# EAGLE design mainboard (EAGLE 6.6.0)
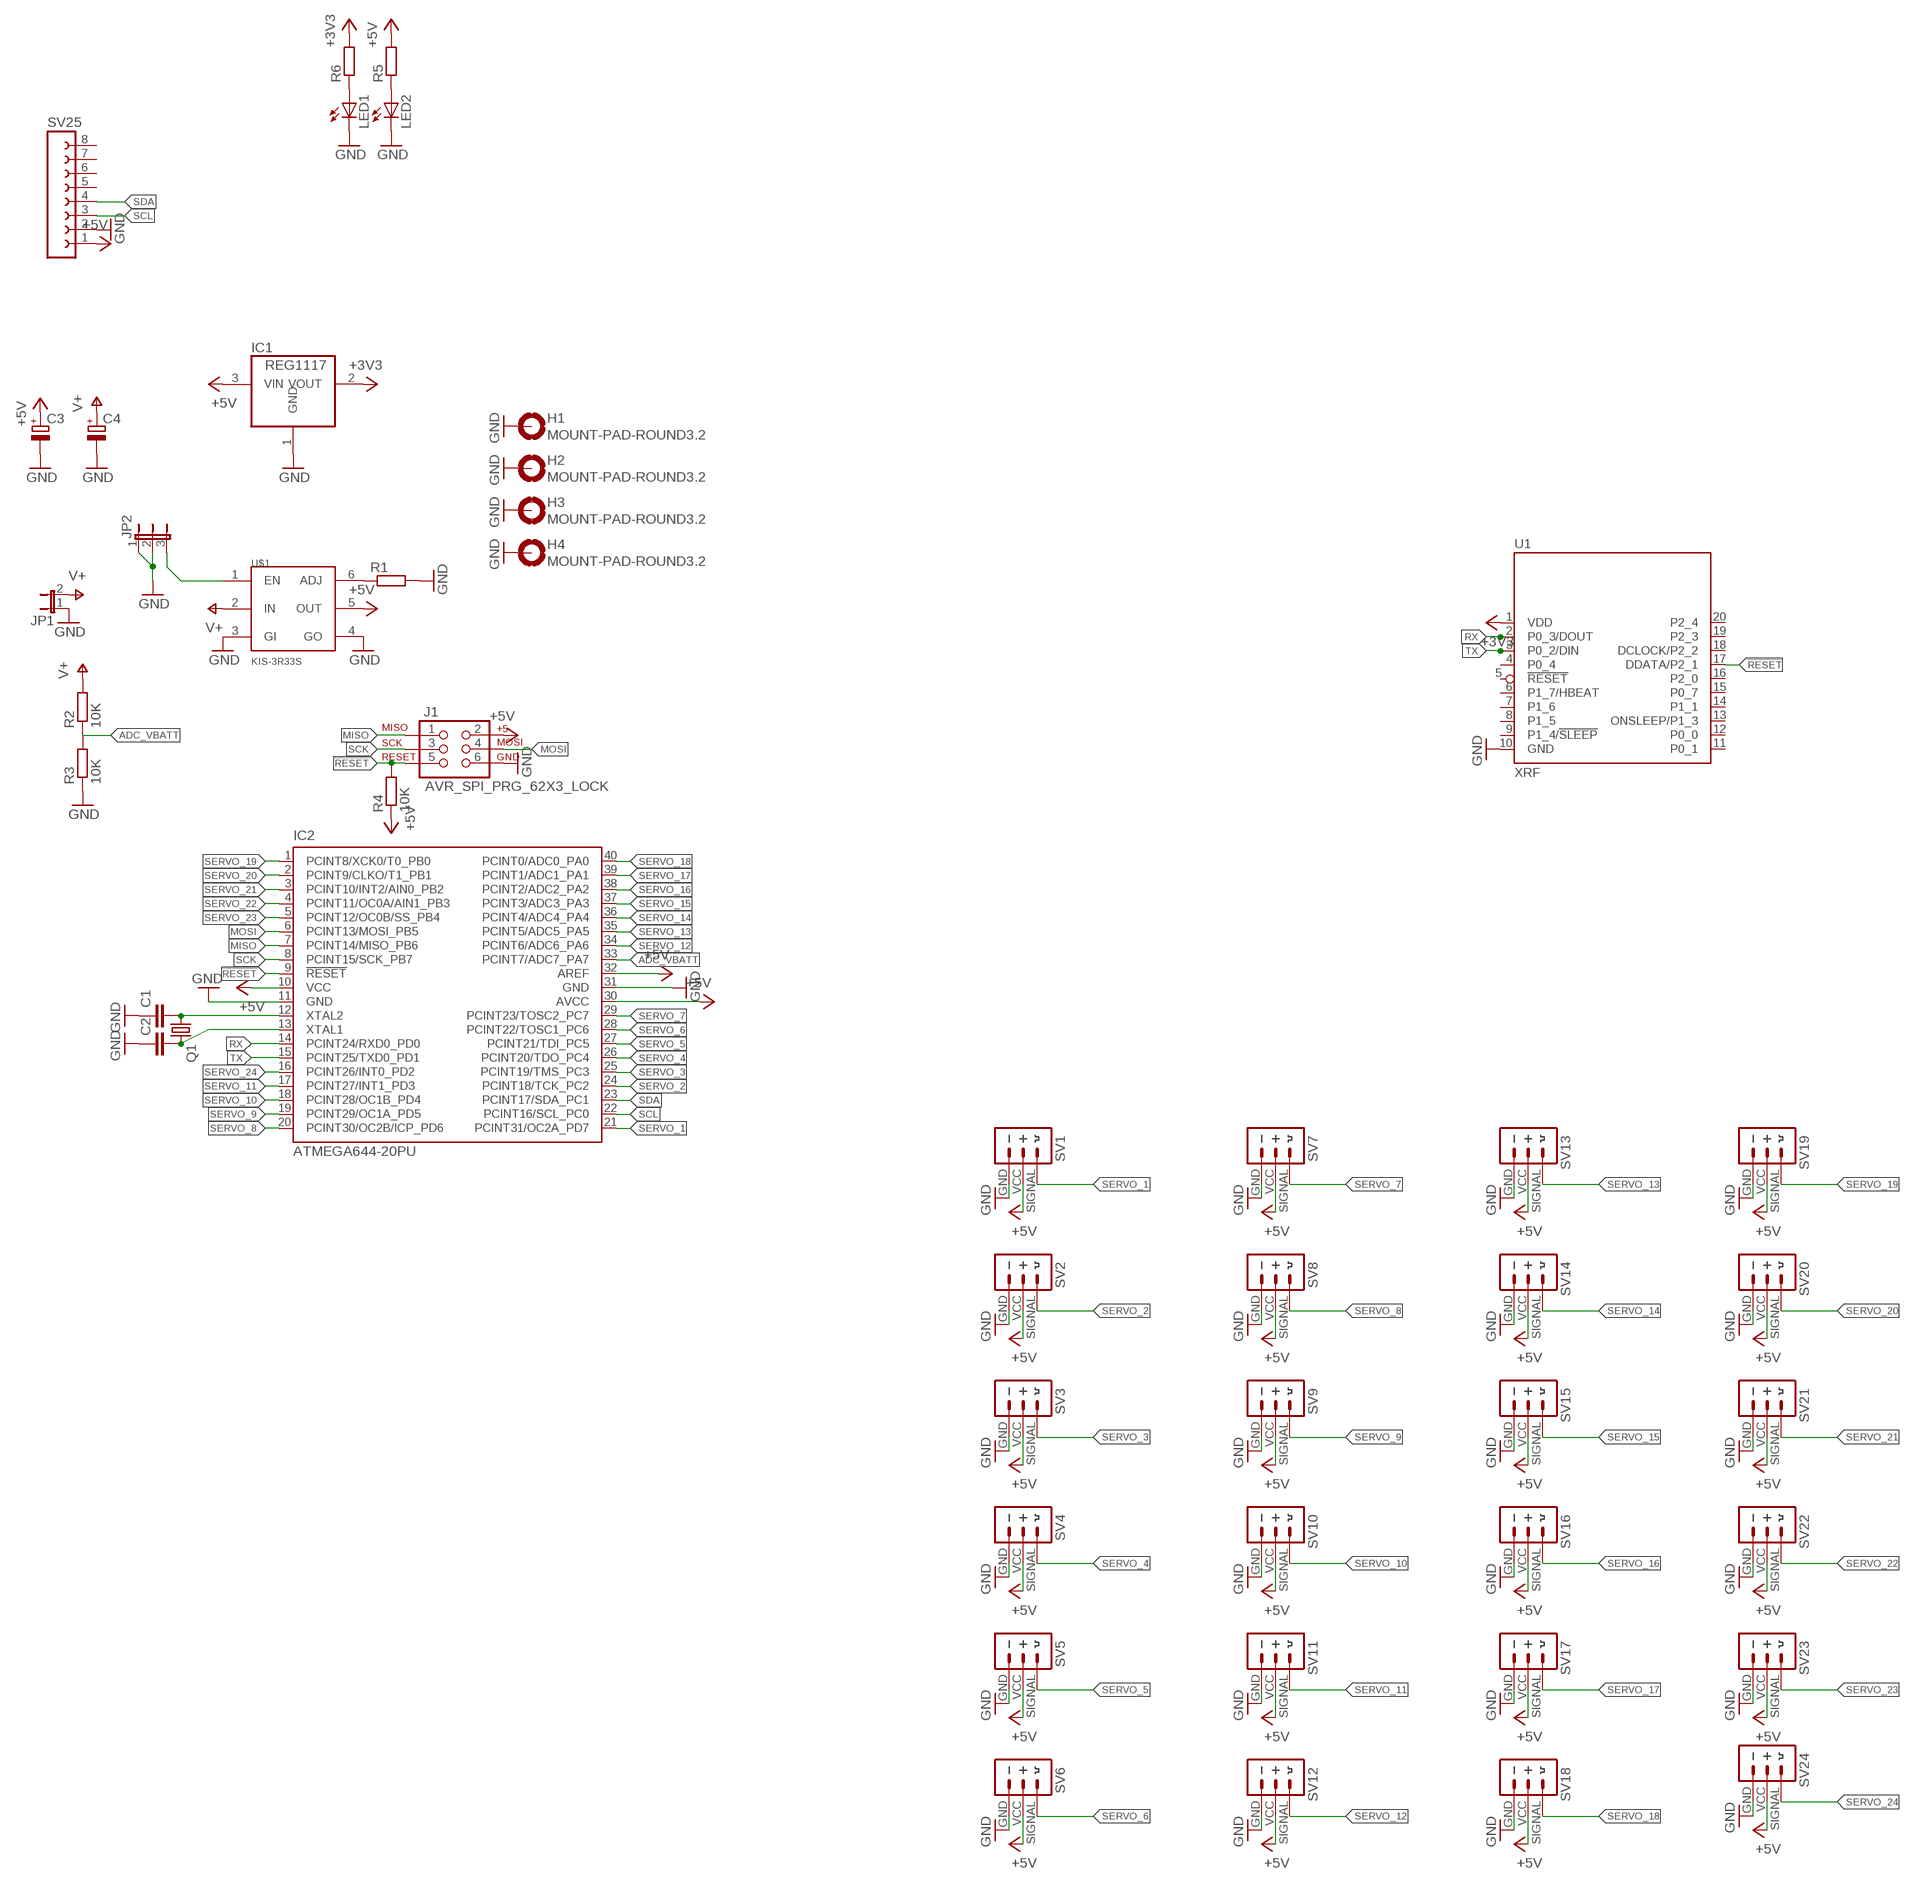
[diagram p0: schematic, sheet 1]

## Parts
C1  C-EU025-025X050  [C025-025X050]
C2  C-EU025-025X050  [C025-025X050]
C3  CPOL-EUE2.5-7  [E2,5-7]
C4  CPOL-EUE2.5-7  [E2,5-7]
H1  MOUNT-PAD-ROUND3.2  [3,2-PAD]
H2  MOUNT-PAD-ROUND3.2  [3,2-PAD]
H3  MOUNT-PAD-ROUND3.2  [3,2-PAD]
H4  MOUNT-PAD-ROUND3.2  [3,2-PAD]
IC1  REG1117  [SOT223]
IC2  ATMEGA644-20PU  [DIL40]
J1  AVR_SPI_PRG_62X3_LOCK  [2X3_LOCK]
JP1  JP1E  [JP1]
JP2  JP2E  [JP2]
LED1  LED5MM  [LED5MM]
LED2  LED5MM  [LED5MM]
Q1  CRYSTALHC49U-V  [HC49U-V]
R1  R-EU_0207/10  [0207/10]
R2  10K  R-EU_0204/5  [0204/5]
R3  10K  R-EU_0204/5  [0204/5]
R4  10K  R-EU_0204/2V  [0204V]
R5  R-EU_0204/2V  [0204V]
R6  R-EU_0204/2V  [0204V]
SV1  SERVO  [SERVO]
SV2  SERVO  [SERVO]
SV3  SERVO  [SERVO]
SV4  SERVO  [SERVO]
SV5  SERVO  [SERVO]
SV6  SERVO  [SERVO]
SV7  SERVO  [SERVO]
SV8  SERVO  [SERVO]
SV9  SERVO  [SERVO]
SV10  SERVO  [SERVO]
SV11  SERVO  [SERVO]
SV12  SERVO  [SERVO]
SV13  SERVO  [SERVO]
SV14  SERVO  [SERVO]
SV15  SERVO  [SERVO]
SV16  SERVO  [SERVO]
SV17  SERVO  [SERVO]
SV18  SERVO  [SERVO]
SV19  SERVO  [SERVO]
SV20  SERVO  [SERVO]
SV21  SERVO  [SERVO]
SV22  SERVO  [SERVO]
SV23  SERVO  [SERVO]
SV24  SERVO  [SERVO]
SV25  FE08-1  [FE08]
U1  XRF  [XRF]
U$1  KIS-3R33S  [KIS-3R33S]

## Nets
!RESET: IC2.9(!RESET) J1.5 R4.2 U1.17(DDATA/P2_1)
+3V3: IC1.2(VOUT) R6.2 U1.1(VDD)
+5V: C3.+ IC1.3(VIN) IC2.10(VCC) IC2.30(AVCC) IC2.32(AREF) J1.2 R4.1 R5.2 SV1.VCC SV2.VCC SV3.VCC SV4.VCC SV5.VCC SV6.VCC SV7.VCC SV8.VCC SV9.VCC SV10.VCC SV11.VCC SV12.VCC SV13.VCC SV14.VCC SV15.VCC SV16.VCC SV17.VCC SV18.VCC SV19.VCC SV20.VCC SV21.VCC SV22.VCC SV23.VCC SV24.VCC SV25.1 U$1.5(OUT)
ADC_VBATT: IC2.33(PCINT7/ADC7_PA7) R2.1 R3.2
GND: C1.1 C2.1 C3.- C4.- H1.B3,2(MOUNT) H2.B3,2(MOUNT) H3.B3,2(MOUNT) H4.B3,2(MOUNT) IC1.1(GND) IC2.11(GND) IC2.31(GND) J1.6 JP1.1 JP2.1 JP2.2 LED1.K(C) LED2.K(C) R1.2 R3.1 SV1.GND SV2.GND SV3.GND SV4.GND SV5.GND SV6.GND SV7.GND SV8.GND SV9.GND SV10.GND SV11.GND SV12.GND SV13.GND SV14.GND SV15.GND SV16.GND SV17.GND SV18.GND SV19.GND SV20.GND SV21.GND SV22.GND SV23.GND SV24.GND SV25.2 U1.10(GND) U$1.3(GI) U$1.4(GO)
MISO: IC2.7(PCINT14/MISO_PB6) J1.1
MOSI: IC2.6(PCINT13/MOSI_PB5) J1.4
N$1: R1.1 U$1.6(ADJ)
N$2: C1.2 IC2.12(XTAL2) Q1.1
N$3: C2.2 IC2.13(XTAL1) Q1.2
N$4: JP2.3 U$1.1(EN)
N$5: LED2.A R5.1
N$6: LED1.A R6.1
RX: IC2.14(PCINT24/RXD0_PD0) U1.2(P0_3/DOUT)
SCK: IC2.8(PCINT15/SCK_PB7) J1.3
SCL: IC2.22(PCINT16/SCL_PC0) SV25.3
SDA: IC2.23(PCINT17/SDA_PC1) SV25.4
SERVO_1: IC2.21(PCINT31/OC2A_PD7) SV1.SIGNAL
SERVO_2: IC2.24(PCINT18/TCK_PC2) SV2.SIGNAL
SERVO_3: IC2.25(PCINT19/TMS_PC3) SV3.SIGNAL
SERVO_4: IC2.26(PCINT20/TDO_PC4) SV4.SIGNAL
SERVO_5: IC2.27(PCINT21/TDI_PC5) SV5.SIGNAL
SERVO_6: IC2.28(PCINT22/TOSC1_PC6) SV6.SIGNAL
SERVO_7: IC2.29(PCINT23/TOSC2_PC7) SV7.SIGNAL
SERVO_8: IC2.20(PCINT30/OC2B/ICP_PD6) SV8.SIGNAL
SERVO_9: IC2.19(PCINT29/OC1A_PD5) SV9.SIGNAL
SERVO_10: IC2.18(PCINT28/OC1B_PD4) SV10.SIGNAL
SERVO_11: IC2.17(PCINT27/INT1_PD3) SV11.SIGNAL
SERVO_12: IC2.34(PCINT6/ADC6_PA6) SV12.SIGNAL
SERVO_13: IC2.35(PCINT5/ADC5_PA5) SV13.SIGNAL
SERVO_14: IC2.36(PCINT4/ADC4_PA4) SV14.SIGNAL
SERVO_15: IC2.37(PCINT3/ADC3_PA3) SV15.SIGNAL
SERVO_16: IC2.38(PCINT2/ADC2_PA2) SV16.SIGNAL
SERVO_17: IC2.39(PCINT1/ADC1_PA1) SV17.SIGNAL
SERVO_18: IC2.40(PCINT0/ADC0_PA0) SV18.SIGNAL
SERVO_19: IC2.1(PCINT8/XCK0/T0_PB0) SV19.SIGNAL
SERVO_20: IC2.2(PCINT9/CLKO/T1_PB1) SV20.SIGNAL
SERVO_21: IC2.3(PCINT10/INT2/AIN0_PB2) SV21.SIGNAL
SERVO_22: IC2.4(PCINT11/OC0A/AIN1_PB3) SV22.SIGNAL
SERVO_23: IC2.5(PCINT12/OC0B/SS_PB4) SV23.SIGNAL
SERVO_24: IC2.16(PCINT26/INT0_PD2) SV24.SIGNAL
TX: IC2.15(PCINT25/TXD0_PD1) U1.3(P0_2/DIN)
V+: C4.+ JP1.2 R2.2 U$1.2(IN)
Unconnected: SV25.5 SV25.6 SV25.7 SV25.8 U1.4(P0_4) U1.5(!RESET) U1.6(P1_7/HBEAT) U1.7(P1_6) U1.8(P1_5) U1.9(P1_4/!SLEEP) U1.11(P0_1) U1.12(P0_0) U1.13(ONSLEEP/P1_3) U1.14(P1_1) U1.15(P0_7) U1.16(P2_0) U1.18(DCLOCK/P2_2) U1.19(P2_3) U1.20(P2_4)

## Library data of the parts
C1 C2 = rcl:C-EU: CAPACITOR, European symbol
C3 C4 = rcl:CPOL-EU: POLARIZED CAPACITOR, European symbol
H1-H4 = holes:MOUNT-PAD-ROUND: MOUNTING PAD, round
IC1 = burr-brown:REG1117: 800mA and 1A Low Dropout (LDO) Positive Regulator 1.8V, 2.5V, 2.85V, 3.3V, 5V, and Adj; MPN: REG1117; OC_FARNELL: 1097566; OC_NEWARK: 14P6981
IC2 = atmel:ATMEGA644-*PU: 8-bit Microcontroller with 64K Bytes In-System Programmable Flash Auto generated by make-symbol-device-package-bsdl.ulp Rev. 34 Source: http://www.atmel.com/dyn/resources/prod_documents/doc2593.pdf; MPN: ATMEGA644-20PU; OC_FARNELL: 1288340; OC_NEWARK: 23M5060
J1 = avr_prog:AVR_SPI_PRG_6: AVR ISP 6 Pin This is the reduced ISP connector for AVR programming. Common on Arduino. This footprint will take up less PCB space and can be used with a 10-pin to 6-pin adapter such as SKU: BOB-08508
JP1 = jumper:JP1E: JUMPER
JP2 = jumper:JP2E: JUMPER
LED1 LED2 = led:LED: LED OSRAM: - CHIPLED LG R971, LG N971, LY N971, LG Q971, LY Q971, LO R971, LY R971 LH N974, LH R974 LS Q976, LO Q976, LY Q976 LO Q996 - Hyper CHIPLED LW Q18S LB Q993, LB Q99A, LB R99A - SideLED LS A670, LO A670, LY A670, LG A670, LP A670 LB A673, LV A673, LT A673, LW A673 LH A674 LY A675 LS A676, LA A676, LO A676, LY A676, LW A676 LS A679, LY A679, LG A679 - Hyper Micro SIDELED® LS Y876, LA Y876, LO Y876, LY Y876 LT Y87S - SmartLED LW L88C, LW L88S LB L89C, LB L89S, LG L890 LS L89K, LO L89K, LY L89K LS L896, LA L896, LO L896, LY L896 - TOPLED LS T670, LO T670, LY T670, LG T670, LP T670 LSG T670, LSP T670, LSY T670, LOP T670, LYG T670 LG T671, LOG T671, LSG T671 LB T673, LV T673, LT T673, LW T673 LH T674 LS T676, LA T676, LO T676, LY T676, LB T676, LH T676, LSB T676, LW T676 LB T67C, LV T67C, LT T67C, LS T67K, LO T67K, LY T67K, LW E67C LS E67B, LA E67B, LO E67B, LY E67B, LB E67C, LV E67C, LT E67C LW T67C LS T679, LY T679, LG T679 LS T770, LO T770, LY T770, LG T770, LP T770 LB T773, LV T773, LT T773, LW T773 LH T774 LS E675, LA E675, LY E675, LS T675 LS T776, LA T776, LO T776, LY T776, LB T776 LHGB T686 LT T68C, LB T68C - Hyper Mini TOPLED® LB M676 - Mini TOPLED Santana® LG M470 LS M47K, LO M47K, LY M47K Source: http://www.osram.convergy.de LUXEON: - LUMILED® LXK2-PW12-R00, LXK2-PW12-S00, LXK2-PW14-U00, LXK2-PW14-V00 LXK2-PM12-R00, LXK2-PM12-S00, LXK2-PM14-U00 LXK2-PE12-Q00, LXK2-PE12-R00, LXK2-PE12-S00, LXK2-PE14-T00, LXK2-PE14-U00 LXK2-PB12-K00, LXK2-PB12-L00, LXK2-PB12-M00, LXK2-PB14-N00, LXK2-PB14-P00, LXK2-PB14-Q00 LXK2-PR12-L00, LXK2-PR12-M00, LXK2-PR14-Q00, LXK2-PR14-R00 LXK2-PD12-Q00, LXK2-PD12-R00, LXK2-PD12-S00 LXK2-PH12-R00, LXK2-PH12-S00 LXK2-PL12-P00, LXK2-PL12-Q00, LXK2-PL12-R00 Source: www.luxeon.com KINGBRIGHT: KA-3528ASYC Source: www.kingbright.com
Q1 = crystal:CRYSTAL: CRYSTAL; OC_FARNELL: 1666969; OC_NEWARK: unknown
R1-R6 = rcl:R-EU_: RESISTOR, European symbol
SV1-SV24 = parag0n:SERVO: SERVO CONNECTOR Standard pinout servo connector
SV25 = con-lsta:FE08-1: FEMALE HEADER; OC_FARNELL: unknown; OC_NEWARK: unknown
U1 = Ciseco%20Footprints:XRF: XRF Wireless UART Serial Data Module. www.ciseco.co.uk
U$1 = KIS-3R33S:KIS-3R33S: DC-DC Converter

## Board
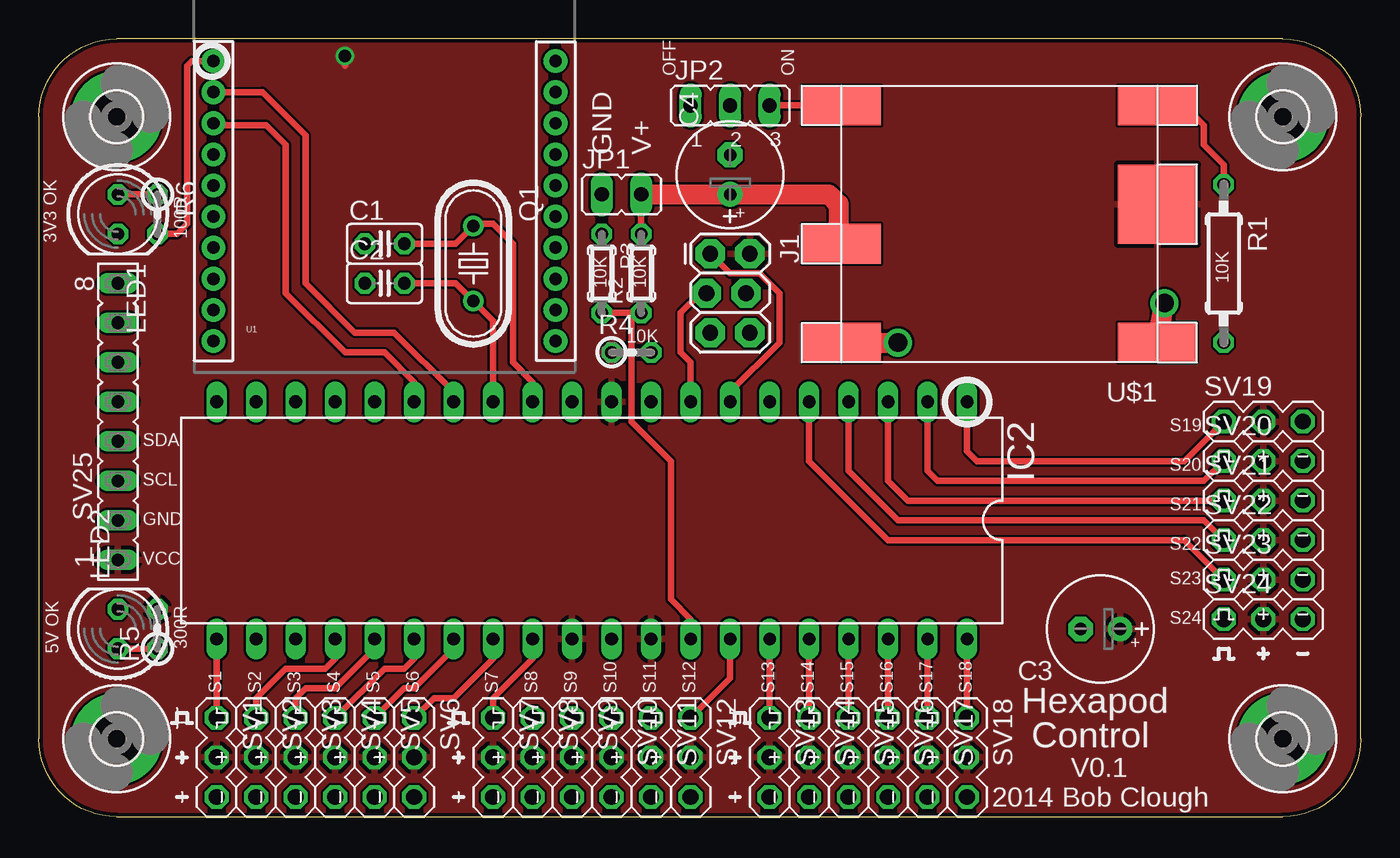
[diagram p1: board, top side]
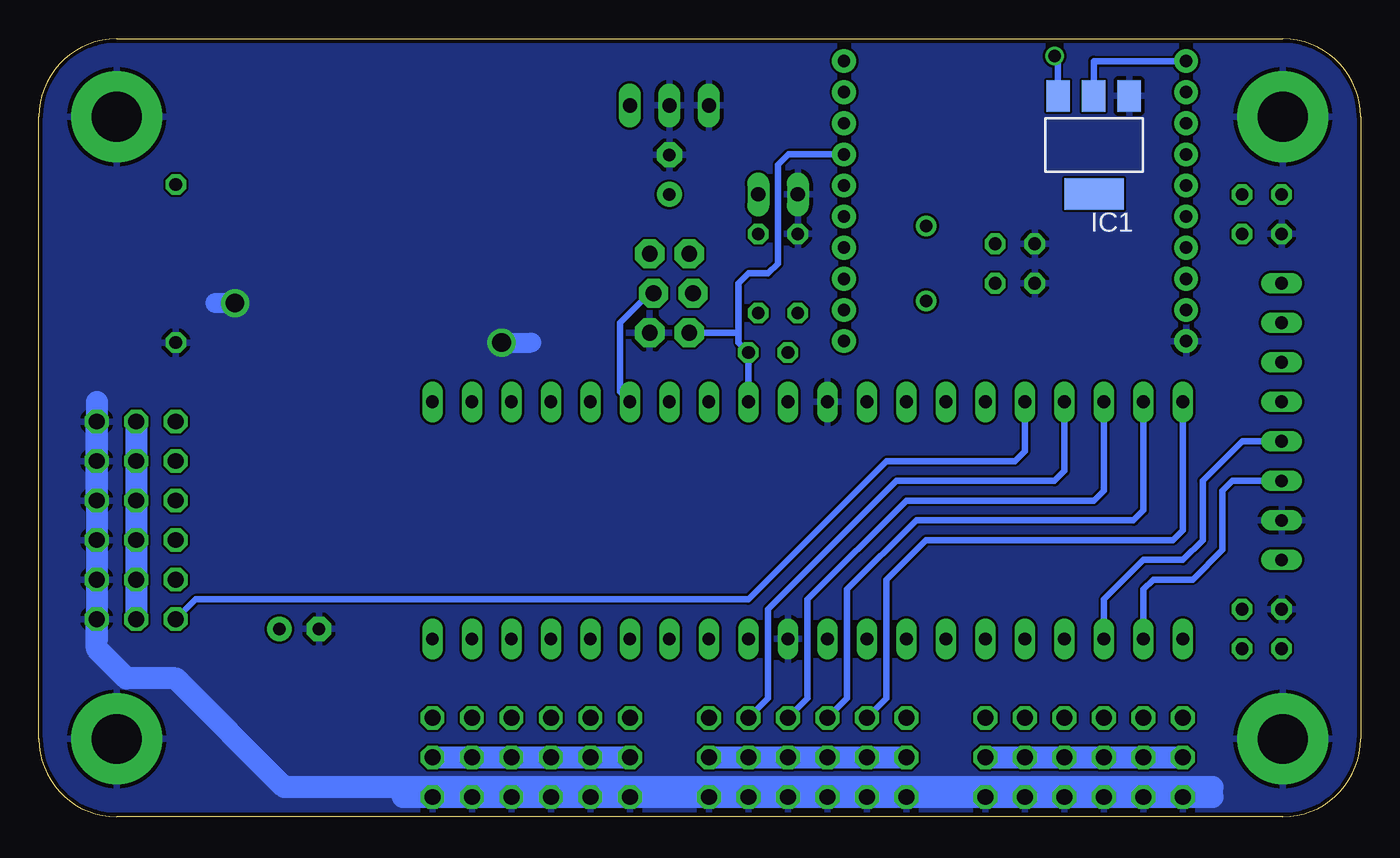
[diagram p2: board, bottom side, seen from below]

Size 85 x 50 mm. Coordinates in mm from the lower left corner, seen from the top.
Outline: 5,0 80,0 arc90 85,5 85,45 arc90 80,50 5,50 arc90 0,45 0,5 arc90 5,0
Copper layers (1*16): Top 0.035mm / dielectric 1.5mm / Bottom 0.035mm
Design rules "Elecrow_2-layer_eagle_rule": minimum track width 6mil, minimum drill 12mil, track to track 6mil, track to pad 6mil, pad to pad 6mil, via to via 6mil, smd to smd 0mil, copper to edge 10mil, drill to drill 10mil, minimum pad ring 10mil, minimum via ring 6mil, stop-mask expansion 2mil, vias tented up to drill 100mil, thermal gap 10mil
bRestrict: 8 lines

### Footprints (pad centres in the part's own frame; a part is rotated, then mirrored left to right if it is on the bottom)
C025-025X050 = drill 0.813 octagon: 1 -1.27,0; 2 1.27,0
E2,5-7 = drill 0.813 pad 1.6: + -1.27,0 | drill 0.813 pad 1.6 octagon: - 1.27,0
3,2-PAD = drill 3.2 pad 5.842: B3,2 0,0
SOT223 = smd 1.499 x 2.007: 1 -2.261,-3.15; 2 0.025,-3.15; 3 2.311,-3.15 | smd 3.81 x 2.007: 4 0,3.15
DIL40 = drill 0.813 long: 1 -24.13,-7.62; 2 -21.59,-7.62; 3 -19.05,-7.62; 4 -16.51,-7.62; 5 -13.97,-7.62; 6 -11.43,-7.62; 7 -8.89,-7.62; 8 -6.35,-7.62; 9 -3.81,-7.62; 10 -1.27,-7.62; 11 1.27,-7.62; 12 3.81,-7.62; 13 6.35,-7.62; 14 8.89,-7.62; 15 11.43,-7.62; 16 13.97,-7.62; 17 16.51,-7.62; 18 19.05,-7.62; 19 21.59,-7.62; 20 24.13,-7.62; 21 24.13,7.62; 22 21.59,7.62; 23 19.05,7.62; 24 16.51,7.62; 25 13.97,7.62; 26 11.43,7.62; 27 8.89,7.62; 28 6.35,7.62; 29 3.81,7.62; 30 1.27,7.62; 31 -1.27,7.62; 32 -3.81,7.62; 33 -6.35,7.62; 34 -8.89,7.62; 35 -11.43,7.62; 36 -13.97,7.62; 37 -16.51,7.62; 38 -19.05,7.62; 39 -21.59,7.62; 40 -24.13,7.62
2X3_LOCK = drill 1.016 pad 1.88 octagon: 1 0,0; 2 0,2.54; 3 2.54,-0.254; 4 2.54,2.286; 5 5.08,0; 6 5.08,2.54
JP1 = drill 0.914 long: 1 0,-1.27; 2 0,1.27
JP2 = drill 0.914 long: 1 -2.54,0; 2 0,0; 3 2.54,0
LED5MM = drill 0.813 octagon: A -1.27,0; K 1.27,0
HC49U-V = drill 0.813: 1 -2.413,0; 2 2.413,0
0207/10 = drill 0.813 octagon: 1 -5.08,0; 2 5.08,0
0204/5 = drill 0.813 octagon: 1 -2.54,0; 2 2.54,0
0204V = drill 0.813 octagon: 1 -1.27,0; 2 1.27,0
SERVO = drill 1.016 octagon: GND 2.54,0; SIGNAL -2.54,0; VCC 0,0
FE08 = drill 0.813 long: 1 -8.89,0; 2 -6.35,0; 3 -3.81,0; 4 -1.27,0; 5 1.27,0; 6 3.81,0; 7 6.35,0; 8 8.89,0
XRF = drill 0.8 pad 1.524: 1 -11,20; 2 -11,18; 3 -11,16; 4 -11,14; 5 -11,12; 6 -11,10; 7 -11,8; 8 -11,6; 9 -11,4; 10 -11,2; 11 11,2; 12 11,4; 13 11,6; 14 11,8; 15 11,10; 16 11,12; 17 11,14; 18 11,16; 19 11,18; 20 11,20
KIS-3R33S = smd 5.08 x 2.54: 1 10.16,-7.62; 2 10.16,1.27; 3 10.16,7.62; 4 -10.16,7.62; 6 -10.16,-7.62 | smd 5.08 x 5.08: 5 -10.16,-1.27

### Placement (x,y rotation side)
C1  22.23,36.83 0 top
C2  22.23,34.29 0 top
C3  68.26,12.06 180 top
C4  44.45,41.27 90 top
H1  5,5 0 top
H2  5,45 0 top
H3  80,45 0 top
H4  80,5 0 top
IC1  17.14,43.18 180 bottom
IC2  35.56,19.05 180 top
J1  43.18,36.2 270 top
JP1  37.47,40.01 270 top
JP2  44.45,45.72 0 top
LED1  5.08,38.73 270 top
LED2  5.08,12.06 90 top
Q1  27.94,35.56 270 top
R1  76.2,35.56 270 top
R2  38.73,34.92 90 top
R3  36.2,34.92 270 top
R4  38.1,29.84 0 top
R5  7.62,12.06 90 top
R6  7.62,38.73 270 top
SV1  11.43,3.81 270 top
SV2  13.97,3.81 270 top
SV3  16.51,3.81 270 top
SV4  19.05,3.81 270 top
SV5  21.59,3.81 270 top
SV6  24.13,3.81 270 top
SV7  29.21,3.81 270 top
SV8  31.75,3.81 270 top
SV9  34.29,3.81 270 top
SV10  36.83,3.81 270 top
SV11  39.37,3.81 270 top
SV12  41.91,3.81 270 top
SV13  46.99,3.81 270 top
SV14  49.53,3.81 270 top
SV15  52.07,3.81 270 top
SV16  54.61,3.81 270 top
SV17  57.15,3.81 270 top
SV18  59.69,3.81 270 top
SV19  78.74,25.4 0 top
SV20  78.74,22.86 0 top
SV21  78.74,20.32 0 top
SV22  78.74,17.78 0 top
SV23  78.74,15.24 0 top
SV24  78.74,12.7 0 top
SV25  5.08,25.4 90 top
U1  22.23,28.57 0 top
U$1  61.77,38.1 180 top

### Tracks (layer width: path | path; a pad name or v marks a point on that pad's centre or on a via)
!RESET
  Bottom 0.406: 39.37,27.94 IC2.9 R4.2 40.01,30.48 40.01,31.11 | U1.17 36.8,42.58 37.47,41.91 37.47,35.56 38.1,34.92 39.37,34.92 40.01,34.29 40.01,31.11 | J1.5 40.01,31.11
+3V3
  Top 0.406: R6.2 8.89,37.47 9.53,38.1 9.53,48.26 9.84,48.58 U1.1
  Bottom 0.406: IC1.2 17.17,48.58 U1.1
+5V  (via drill 0.8)
  Top 0.406: v19.68,48.9 19.68,48.26
  Bottom 0.406: IC1.3 19.46,48.67 v19.68,48.9
  Bottom 1.422: SV19.VCC SV24.VCC | SV18.VCC SV13.VCC | SV12.VCC SV7.VCC | SV6.VCC SV1.VCC
  pour Top: -0.64,53.98 87.47,53.98 87.47,-3.81 -0.64,-3.81
ADC_VBATT
  Top 0.406: R3.2 38.1,32.38 | 38.1,32.38 R2.1 | IC2.33 41.91,12.7 40.64,13.97 40.64,22.86 38.1,25.4 38.1,32.38
GND  (via drill 1.2)
  Top 1.27: U$1.3 v55.24,30.48 | U$1.4 v72.39,33.02
  Bottom 1.27: v55.24,30.48 53.34,30.48 | v72.39,33.02 73.66,33.02
  Bottom 1.422: SV1.GND 10.16,1.27 | SV24.GND 81.28,11.43 | 61.59,1.27 SV18.GND SV17.GND SV16.GND SV15.GND SV14.GND SV13.GND SV12.GND SV11.GND SV10.GND SV9.GND SV8.GND SV7.GND SV6.GND SV5.GND SV4.GND SV3.GND SV2.GND SV1.GND | SV1.GND 9.53,1.27 9.53,1.91 69.22,1.91 76.2,8.89 79.38,8.89 81.28,10.79 SV24.GND | SV24.GND SV23.GND SV22.GND SV21.GND | SV19.GND SV20.GND SV21.GND | SV21.GND SV19.GND | 81.28,26.67 SV19.GND
  pour Bottom: -1.91,50.8 89.93,50.8 89.93,-4.45 -1.91,-4.45
MISO
  Top 0.406: J1.1 44.45,34.92 46.35,34.92 47.62,33.66 47.62,30.48 44.45,27.3 IC2.7
MOSI
  Bottom 0.406: J1.4 45.72,33.66 47.62,31.75 47.62,27.3 IC2.6
N$1
  Top 0.406: U$1.6 73.66,45.72 74.93,44.45 74.93,43.18 76.2,41.91 R1.1
N$2
  Top 0.406: IC2.12 31.75,27.94 30.48,29.21 30.48,36.83 29.21,38.1 28.07,38.1 Q1.1 26.8,36.83 C1.2
N$3
  Top 0.406: IC2.13 29.21,31.88 Q1.2 26.8,34.29 C2.2
N$4
  Top 0.406: JP2.3 U$1.1
N$5
  Top 0.406: R5.1 LED2.A
N$6
  Top 0.406: R6.1 LED1.A
RX
  Top 0.406: IC2.14 26.67,27.3 22.86,31.11 20.32,31.11 17.14,34.29 17.14,43.81 14.38,46.58 U1.2
SCK
  Top 0.406: J1.3 42.55,33.66 41.27,32.38 41.27,29.84 41.91,29.21 IC2.8
SCL
  Bottom 0.406: SV25.3 8.26,21.59 8.89,20.95 8.89,17.14 10.79,15.24 13.34,15.24 13.97,14.61 IC2.22
SDA
  Bottom 0.406: SV25.4 7.62,24.13 10.16,21.59 10.16,17.78 11.43,16.51 13.97,16.51 16.51,13.97 IC2.23
SERVO_1
  Top 0.406: IC2.21 SV1.SIGNAL
SERVO_2
  Top 0.406: IC2.24 19.05,10.16 18.41,9.53 15.88,9.53 13.97,7.62 SV2.SIGNAL
SERVO_3
  Top 0.406: IC2.25 21.59,10.79 19.05,8.26 17.14,8.26 16.51,7.62 SV3.SIGNAL
SERVO_4
  Top 0.406: IC2.26 24.13,10.16 23.5,9.53 22.23,9.53 SV4.SIGNAL
SERVO_5
  Top 0.406: IC2.27 26.67,10.79 24.13,8.26 23.5,8.26 SV5.SIGNAL
SERVO_6
  Top 0.406: IC2.28 29.21,10.16 26.67,7.62 25.4,7.62 SV6.SIGNAL
SERVO_7
  Top 0.406: IC2.29 31.75,10.16 29.21,7.62 SV7.SIGNAL
SERVO_8
  Bottom 0.406: IC2.20 11.43,18.41 12.06,17.78 27.94,17.78 30.48,15.24 30.48,7.62 SV8.SIGNAL
SERVO_9
  Bottom 0.406: IC2.19 13.97,19.68 14.61,19.05 28.57,19.05 33.02,14.61 33.02,7.62 SV9.SIGNAL
SERVO_10
  Bottom 0.406: IC2.18 16.51,20.95 17.14,20.32 29.21,20.32 35.56,13.97 35.56,7.62 SV10.SIGNAL
SERVO_11
  Bottom 0.406: IC2.17 19.05,22.23 19.68,21.59 29.84,21.59 38.1,13.34 38.1,7.62 SV11.SIGNAL
SERVO_12
  Top 0.406: IC2.34 44.45,8.89 SV12.SIGNAL
SERVO_13
  Top 0.406: IC2.35 SV13.SIGNAL
SERVO_14
  Top 0.406: IC2.36 SV14.SIGNAL
SERVO_15
  Top 0.406: IC2.37 SV15.SIGNAL
SERVO_16
  Top 0.406: IC2.38 SV16.SIGNAL
SERVO_17
  Top 0.406: IC2.39 SV17.SIGNAL
SERVO_18
  Top 0.406: IC2.40 SV18.SIGNAL
SERVO_19
  Top 0.406: IC2.1 59.69,23.5 60.33,22.86 73.66,22.86 SV19.SIGNAL
SERVO_20
  Top 0.406: IC2.2 57.15,22.23 57.78,21.59 74.93,21.59 SV20.SIGNAL
SERVO_21
  Top 0.406: IC2.3 54.61,21.59 55.88,20.32 SV21.SIGNAL
SERVO_22
  Top 0.406: IC2.4 52.07,22.23 55.24,19.05 74.93,19.05 SV22.SIGNAL
SERVO_23
  Top 0.406: IC2.5 49.53,22.86 54.61,17.78 73.66,17.78 SV23.SIGNAL
SERVO_24
  Bottom 0.406: SV24.SIGNAL 74.93,13.97 39.37,13.97 30.48,22.86 22.23,22.86 21.59,23.5 IC2.16
TX
  Top 0.406: IC2.15 24.13,27.94 22.23,29.84 19.68,29.84 15.88,33.66 15.88,43.18 14.61,44.45 11.35,44.45 U1.3
V+
  Top 0.406: JP1.2 R2.2
  Top 1.27: JP1.2 C4.+ 45.09,40.01 50.8,40.01 51.44,39.37 51.44,37.01 U$1.2

### Text on the board
_tsilk: OFF | ON | GND | V+ | 3V3 OK | + | 100R | 10K | 10K | 10K | 10K | S19 | SDA | S20 | SCL | S21 | GND | S22 | VCC | S23 | S24 | 300R | + | 5V OK | S1 | S2 | S3 | S4 | S5 | S6 | S7 | S8 | S9 | S10 | S11 | S12 | S13 | S14 | S15 | S16 | S17 | S18 | Hexapod | Control | V0.1 | 2014 Bob Clough